# EAGLE design Transmitter+Bug-2SC9014 (EAGLE 7.6.0)
Simple FM Transmitter with Electret Microphone, based on NPN Transistor
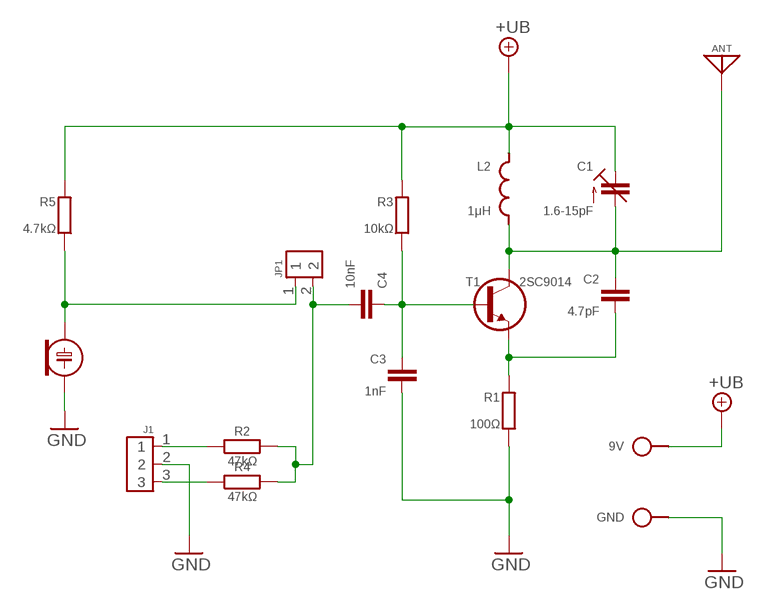
[diagram p0: schematic, sheet 1]

## Parts
9V  SPAD  [SPAD]
ANT  ANT  [SPAD]
C1  1.6-15pF  C-TR-PH201272222-808-2PINB  [TRIM-2222-808]
C2  4.7pF  C025-015X024  [C025-015X024]
C3  1nF  C050-020X036/V  [C050-020X036/V]
C4  10nF  C050-020X036/V  [C050-020X036/V]
ECM1  ECM-5  [ECM-5]
GND  SPAD  [SPAD]
J1  CONN-3P-3P  [CONN-3P]
JP1  CONN-2P2P/V  [CONN-2P-V]
L2  1μH  L-SHORT04-5/5V-X  [L-04-2/5V-X]
R1  100Ω  R0204/2V  [0204/2V]
R2  47kΩ  R-H0204/7-V  [0204/7-V]
R3  10kΩ  R0204/10-V  [0204/10-V]
R4  47kΩ  R-H0204/7-V  [0204/7-V]
R5  4.7kΩ  R0204/10-V  [0204/10-V]
T1  2SC9014  [TO92-EBC]

## Nets
+UB: 9V.1 C1.3(E) L2.1 R3.1 R5.1
GND: C3.2 ECM1.2(-) GND.1 J1.2 R1.1
N$1: J1.3 R4.1
N$2: ANT.1 C1.2(A) C2.1 L2.2 T1.C
N$3: C2.2 R1.2 T1.E
N$4: J1.1 R2.1
N$5: C3.1 C4.1 R3.2 T1.B
N$6: C4.2 JP1.2 R2.2 R4.2
N$7: ECM1.1(+) JP1.1 R5.2

## Library data of the parts
9V GND = pad:SPAD
ANT = pad:ANT
C1 = cap-trim:C-TR-PH20127
C2-C4 = c:C: CAPACITOR, European symbol
ECM1 = ECM:ECM
J1 = pinconn:CONN-3P
JP1 = pinconn:CONN-2P
L2 = l:L-SHORT
R1 R3 R5 = r:R: RESISTOR, European symbol
R2 R4 = r:R-H
T1 = t:2SC9014

## Net classes
0 default: width 0.61 mm

## Board
Simple FM Transmitter with Electret Microphone, based on NPN Transistor
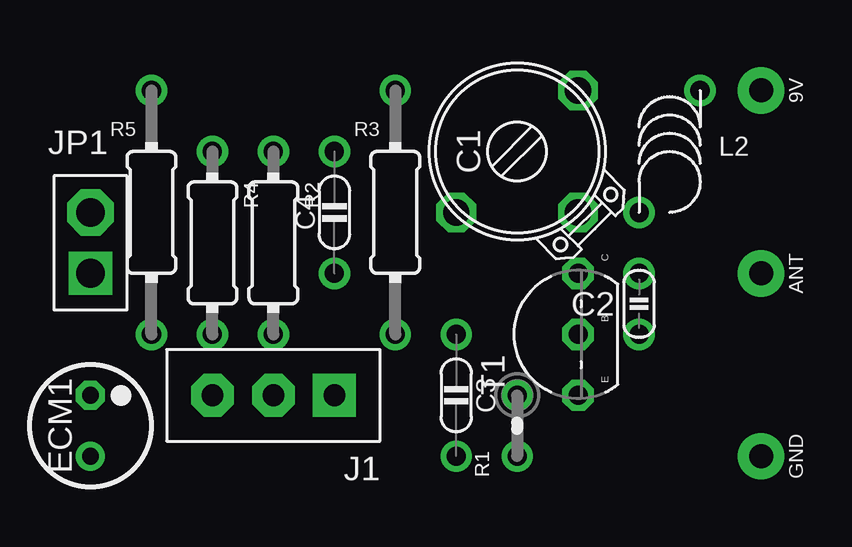
[diagram p1: board, top side]
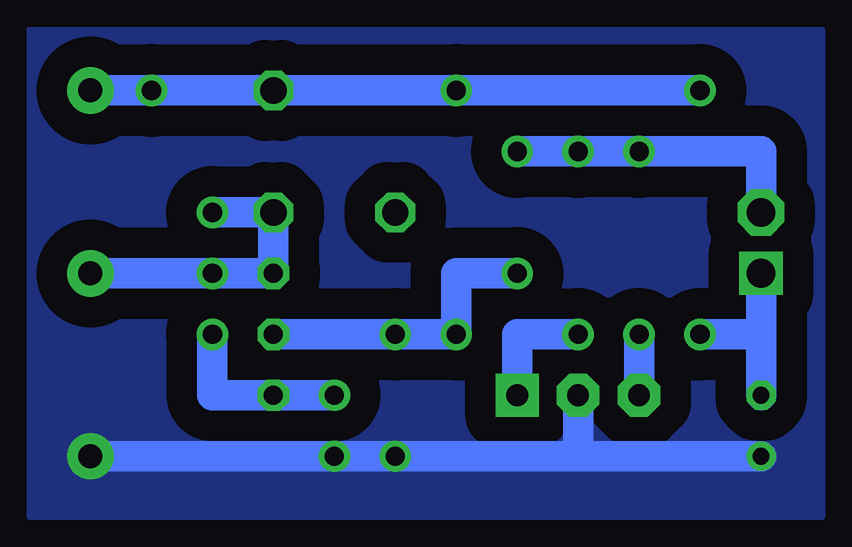
[diagram p2: board, bottom side, seen from below]

No outline drawn. Coordinates in mm, seen from the top.
Copper layers (1*16): Top 0.035mm / dielectric 1.5mm / Bottom 0.035mm
Design rules "default": minimum track width 10mil, minimum drill 24mil, track to track 8mil, track to pad 8mil, pad to pad 8mil, via to via 8mil, smd to smd 8mil, copper to edge 40mil, drill to drill 8mil, minimum pad ring 10mil, minimum via ring 8mil, stop-mask expansion 4mil, vias tented up to drill 0mil, thermal gap 10mil

### Footprints (pad centres in the part's own frame; a part is rotated, then mirrored left to right if it is on the bottom)
SPAD = drill 1 pad 1.93: 1 0,0
TRIM-2222-808 = drill 1.1 octagon: 1 -2.54,2.54; 2 -2.54,-2.54; 3 2.54,-2.54
C025-015X024 = drill 0.8: 1 0,1.27; 2 0,-1.27
C050-020X036/V = drill 0.8: 1 0,-2.54; 2 0,2.54
ECM-5 = drill 0.7 pad 1.2 octagon: 1 0,1.27 | drill 0.7 pad 1.2: 2 0,-1.27
CONN-3P = drill 0.9 pad 1.778 square: 1 0,0 | drill 0.9 pad 1.778 octagon: 2 2.54,0; 3 5.08,0
CONN-2P-V = drill 1.2 pad 1.778 square: 1 0,0 | drill 1.2 pad 1.93 octagon: 2 0,2.54
L-04-2/5V-X = drill 0.8: 1 1.27,2.54; 2 -1.27,-2.54
0204/2V = drill 0.8: 1 -1.27,0; 2 1.27,0
0204/7-V = drill 0.8: 1 0,3.81; 2 0,-3.81
0204/10-V = drill 0.8: 1 0,5.08; 2 0,-5.08
TO92-EBC = drill 0.8 octagon: B 0,-1.27; C 2.54,-1.27; E -2.54,-1.27

### Placement (x,y rotation side)
9V  33.02,17.78 180 top
ANT  33.02,10.16 180 top
C1  22.86,15.24 90 top
C2  27.94,8.89 0 top
C3  20.32,5.08 180 top
C4  15.24,12.7 0 top
ECM1  5.08,3.81 0 top
GND  33.02,2.54 180 top
J1  15.24,5.08 180 top
JP1  5.08,10.16 0 top
L2  1uH  [L-04-2/5V-X]  29.21,15.24 0 top
R1  100  [0204/2V]  22.86,3.81 90 top
R2  47k  [0204/7-V]  12.7,11.43 180 top
R3  10k  [0204/10-V]  17.78,12.7 0 top
R4  47k  [0204/7-V]  10.16,11.43 180 top
R5  4.7k  [0204/10-V]  7.62,12.7 0 top
T1  24.13,7.62 90 top

### Tracks (layer width: path | path; a pad name or v marks a point on that pad's centre or on a via)
+UB
  Bottom 1.27: R5.1 R3.1 C1.3 L2.1 9V.1
GND
  Bottom 1.27: J1.2 12.7,2.54 | GND.1 R1.1 C3.2 12.7,2.54 | ECM1.2 12.7,2.54
  pour Bottom (isolate 1.27, no thermals): 2.54,20.32 2.54,0 35.56,0 35.56,20.32
N$1
  Bottom 1.27: J1.3 R4.1
N$2
  Bottom 1.27: ANT.1 C2.1 T1.C C1.2 L2.2
N$3
  Bottom 1.27: R1.2 T1.E 27.94,5.08 C2.2
N$4
  Bottom 1.27: J1.1 15.24,7.62 R2.1
N$5
  Bottom 1.27: C4.1 17.78,10.16 R3.2 C3.1 T1.B
N$6
  Bottom 1.27: C4.2 R2.2 R4.2 5.08,15.24 JP1.2
N$7
  Bottom 1.27: R5.2 5.08,7.62 JP1.1 ECM1.1